# Altium schematic sheet Nano_Shield.SchDoc
size A4
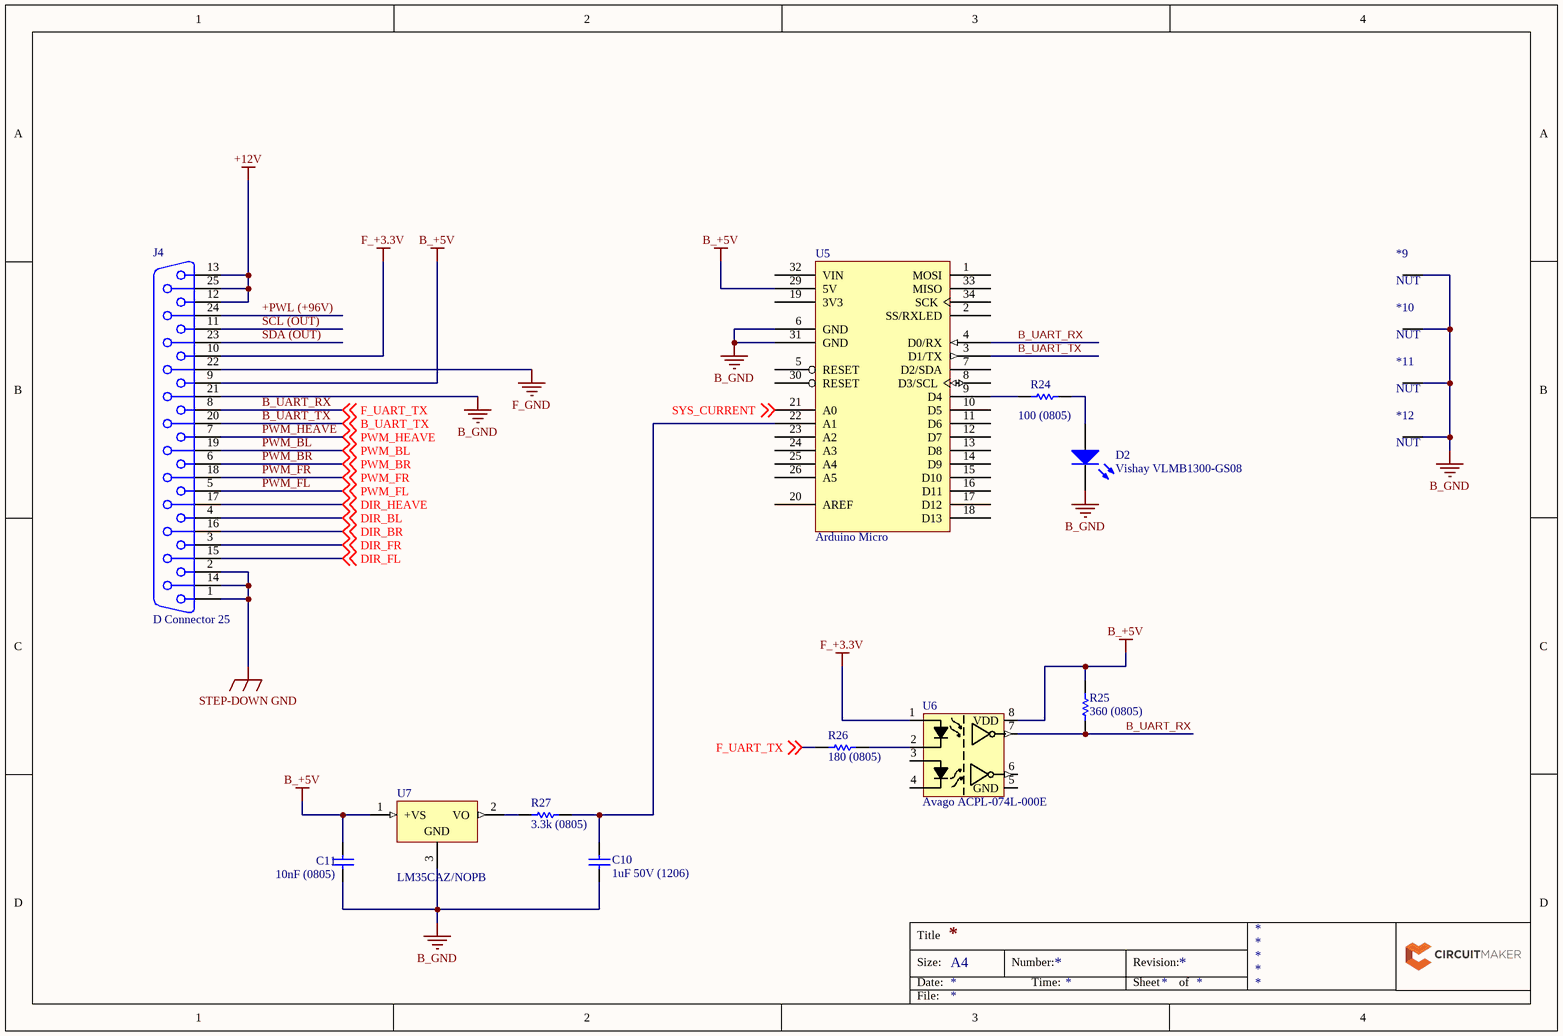
[diagram p0: Nano_Shield.SchDoc]

## Parts
*9  NUT  [PCB-pcj1l6roq5gpi9u538ps-1]
*10  NUT  [PCB-pcj1l6roq5gpi9u538ps-1]
*11  NUT  [PCB-pcj1l6roq5gpi9u538ps-1]
*12  NUT  [PCB-pcj1l6roq5gpi9u538ps-1]
C10  1uF 50V (1206)  [CAPC3216X180X55NL20T25]
C11  10nF (0805)  [CAPC2013X94X50NL20T25]
D2  Vishay VLMB1300-GS08  [0603D_C]
J4  D Connector 25  [PCB-w6wyndea0hgjvu195v0z-1]
R24  100 (0805)  [RESC2013X60X40NL15T20]
R25  360 (0805)  [RESC2013X60X40NL15T20]
R26  180 (0805)  [RESC2013X60X40NL15T20]
R27  3.3k (0805)  [RESC2013X60X40NL15T20]
U5  Arduino Micro  [Soldered]
U6  Avago ACPL-074L-000E  [PCB-tvxoajnlj650fdg499ex-1]
U7  LM35CAZ/NOPB  [Z03A]

## Nets
+12V: J4.12 J4.13 J4.25
B_+5V: C11.2 J4.9 R25.1 U5.29(5V) U6.8(VDD) U7.1(+VS)
B_GND: *9.0 *10.0 *11.0 *12.0 C10.1 C11.1 D2.C J4.21 U5.6(GND) U5.31(GND) U7.3(GND)
F_+3.3V: J4.10 U6.1
F_GND: J4.22
STEP-DOWN GND: J4.1 J4.2 J4.14
+PWL (+96V): J4.24
B_UART_RX: J4.8 R25.2 R26.2 U5.4(D0/RX) U6.7 ; off-sheet F_UART_TX  [also labelled F_UART_TX]
B_UART_TX: J4.20 U5.3(D1/TX) ; off-sheet B_UART_TX
DIR_BL: J4.4 ; off-sheet DIR_BL
DIR_BR: J4.16 ; off-sheet DIR_BR
DIR_FL: J4.15 ; off-sheet DIR_FL
DIR_FR: J4.3 ; off-sheet DIR_FR
DIR_HEAVE: J4.17 ; off-sheet DIR_HEAVE
PWM_BL: J4.19 ; off-sheet PWM_BL
PWM_BR: J4.6 ; off-sheet PWM_BR
PWM_FL: J4.5 ; off-sheet PWM_FL
PWM_FR: J4.18 ; off-sheet PWM_FR
PWM_HEAVE: J4.7 ; off-sheet PWM_HEAVE
SCL (OUT): J4.11
SDA (OUT): J4.23
SYS_CURRENT: U5.21(A0) ; off-sheet SYS_CURRENT
NetC10_2: C10.2 R27.1 U5.22(A1)
NetD2_A: D2.A R24.2
NetR24_1: R24.1 U5.9(D4)
NetR26_1: R26.1 U6.2
NetR27_2: R27.2 U7.2(VO)

Not connected (* = marked no-connect by the designer): U5 1(MOSI) 2(SS/RXLED) 5(RESET) 7(D2/SDA) 8(D3/SCL) 10(D5) 11(D6) 12(D7) 13(D8) 14(D9) 15(D10) 16(D11) 17(D12) 18(D13) 19(3V3) 20(AREF) 23(A2) 24(A3) 25(A4) 26(A5) 30(RESET) 32(VIN) 33(MISO) 34(SCK); U6 3 4 5(GND) 6

## Notes on the sheet
- Title
- Size:
- Date:
- A4
- Number:
- Time:
- Revision:
- Sheet
- of
- File:

## Library data of the parts
*9-*12 = CMP-5ddc94dc62be821b-2: Standoff; 12 mm; M3 x 0.5; Brass; Hex; Nickel Plate; 8 in.; 8 in.; Manufacturer Part Number: 24314; Lead-Free Status: Lead Free; Size-Width: 5.00 mm; Octopart URL: http://octopart.com/24314-keystone-662020; OctopartID: 5ddc94dc62be821b; Size-Length: 12.0 mm; Material: Brass; RoHS: Compliant
C10 = CMP-121173-2: CAP CER 1UF 50V 10% X7R 1206; Capacitance: 1e-06 F; Case/Package (SI): 3216; Lead-Free Status: Lead Free; Voltage Rating (DC): 50.0 V; Capacitance Tolerance: ±10%; Dielectric Characteristic: X7R; Lifecycle Status: Active; Mounting Style: Surface Mount; Octopart Url: https://octopart.com/grm31cr71h105ka61l-murata-197460; OctopartID: 26d9efd000ebf91e; REACH SVHC Compliance: No SVHC; RoHS: Compliant; Size-Length: 0.0032 m; Size-Thickness: 0.0016 m; Size-Width: 0.0016 m
C11 = CMP-16466678-5: CAP CER 10NF 50V 5% X7R 0805; Manufacturer Part Number: 08055C103JAT2A; Case/Package (SI): 2012; Capacitance: 1e-08 F; Voltage Rating (DC): 50.0 V; Dielectric Material: Ceramic Multilayer; Lead-Free Status: Lead Free; Insulation Resistance: 1e+11 ?; Size-Width: 0.0012446 m; REACH SVHC Compliance: No SVHC; Capacitance Tolerance: ±5%; Case/Package: 0805; Mounting Style: Surface Mount; Size-Thickness: 0.0009398 m; Dielectric Characteristic: X7R; Octopart Url: https://octopart.com/08055c103jat2a-avx+interconnect+%2F+elco-39513106; Size-Height: 0.00094 m; Size-Length: 0.0020066 m; Number of Pins: 2; RoHS: Compliant; OctopartID: 02fac9aacb8edd3d
D2 = CMP-1563dd39390dcaa4-2: Blue 0603 130° 180 mcd Clear 3 V Surface Mount LED; Forward Voltage: 3.8 V; Luminous Intensity: 0.18 cd; Lead-Free Status: Lead Free; REACH SVHC Compliance: No SVHC; RoHS: Compliant; Manufacturer Part Number: VLMB1300-GS08; OctopartID: 1563dd39390dcaa4; Packaging: Cut Tape (CT); Viewing Angle: 130 °; Octopart URL: http://octopart.com/vlmb1300-gs08-vishay-22022408
J4 = CMP-d8a713f745850760-3: D Sub Connector, Amplimite HD-20, Amplimite HD-20 Series, DB, Plug, 25, Metal, Solder; Manufacturer Part Number: 5747842-4; ELV Compliant: Compliant; Gender: Male; Lead-Free Status: Lead Free; Pin Pitch: 2.77 mm; Number of Contacts: 25; Orientation: Right Angle; Packaging: Tray; Housing Color: Black; Mounting Style: Through Hole; RoHS: Compliant; Lifecycle Status: Active; Size-Length: 53.0 mm; Color: Black; Contact Plating: Gold over Nickel; OctopartID: d8a713f745850760; Contact Material: Brass; Number of Rows: 2; Size-Height: 12.6 mm; Housing Material: Nylon; Octopart URL: http://octopart.com/5747842-4-te+connectivity+%2F+amp-39499844; REACH SVHC Compliance: No SVHC; Material: Steel; Flammability Rating: UL 94 V-0; Number of Positions: 25; Size-Width: 18.7 mm
R24-R27 = CMP-1860549-2: RES SMD 10K OHM 1% 1/3W 0805; Lead-Free Status: Lead Free; Power Rating: 0.125 W; Resistance: 10000.0 ?; Voltage Rating (DC): 150.0 V; Case/Package: 0805; Mounting Style: Surface Mount; Number of Pins: 2; Octopart Url: https://octopart.com/crcw080510k0fkeahp-vishay-42634554; OctopartID: fa6931e9523525ae; Packaging: Cut Tape (CT); REACH SVHC Compliance: No SVHC; Resistance Tolerance: ±1%; RoHS: Compliant
U5 = CMP-b9da714574fd661d-9: Arduino Micro based on ATMega32u4; Manufacturer Part Number: A000053; Core Architecture: AVR; Arduino: Pro Micro (Mega32U4); Number of Bits: 8; Octopart URL: http://octopart.com/a000053-arduino-26601537; Microcontroller: ATMega32U; RoHS: Compliant; OctopartID: b9da714574fd661d; REACH SVHC Compliance: No SVHC
U6 = CMP-ee2b274cae1231ec-3: Optocoupler Logic-Out Push-Pull DC-IN 2-CH 8-Pin SOIC Tube; Lead-Free Status: Lead Free; Output Voltage: 6.50 V; Input Current: 18.0 mA; Isolation Voltage: 3.75 kV; Number of Pins: 8; Packaging: Tube; Octopart URL: http://octopart.com/acpl-074l-000e-avago-7169375; Manufacturer Part Number: ACPL-074L-000E; REACH SVHC Compliance: No SVHC; Lifecycle Status: Active; RoHS: Compliant; Mounting Style: Surface Mount; OctopartID: ee2b274cae1231ec
U7 = CMP-0066-00028-3: Precision Centigrade Temperature Sensor, 3-pin TO-92, Pb-Free; Lead-Free Status: Lead Free; Output Current: 0.01 A; Output Voltage: 6.0 V; Quiescent Current: 5.6e-05 A; Supply Current: 9.15e-05 A; Supply Voltage (DC): 4.0 V; Case/Package: TO-92; Lifecycle Status: Active; Mounting Style: Through Hole; Number of Pins: 3; Octopart Url: https://octopart.com/lm35caz%2Fnopb-texas+instruments-24814021; OctopartID: c3730b0347d01cb4; Packaging: Box; REACH SVHC Compliance: No SVHC; RoHS: Compliant